# Altium schematic sheet Boost.SchDoc
size Letter
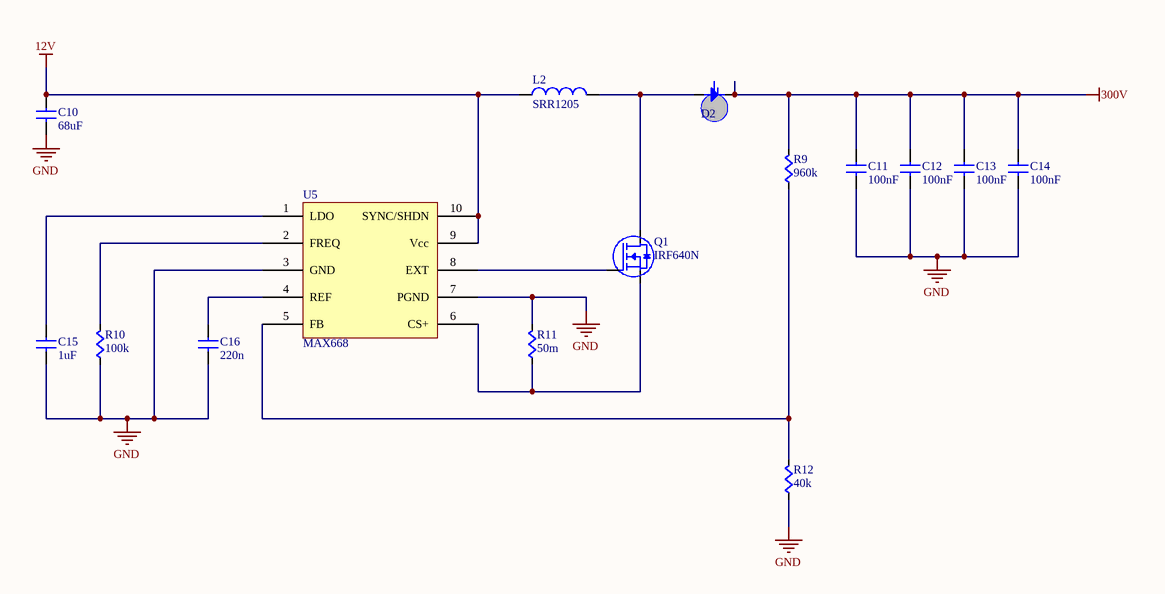
[diagram p0: Boost.SchDoc]

## Parts
C10  value 68uF  [CAPC0603]  (hidden comment: Cap)
C11  value 100nF  [CAPC0603]  (hidden comment: Cap)
C12  value 100nF  [CAPC0603]  (hidden comment: Cap)
C13  value 100nF  [CAPC0603]  (hidden comment: Cap)
C14  value 100nF  [CAPC0603]  (hidden comment: Cap)
C15  value 1uF  [CAPC0402]  (hidden comment: Cap)
C16  value 220n  [CAPC0402]  (hidden comment: Cap)
D2  Diode  [TEMD5510FX01]  (value not drawn)
L2  SRR1205  [SRR1205]
Q1  IRF640N  [IRF640N]
R9  value 960k  [RES0603]  (hidden comment: Res)
R10  value 100k  [RES0603]  (hidden comment: Res)
R11  value 50m  [RES0603]  (hidden comment: Res)
R12  value 40k  [RES0603]  (hidden comment: Res)
U5  MAX668  [MAX668]

## Nets
12V: C10.1(A) L2.1(A) U5.9(Vcc) U5.10(SYNC/SHDN)
300V: C11.1(A) C12.1(A) C13.1(A) C14.1(A) D2.C R9.1(A)
GND: C10.2(B) C11.2(B) C12.2(B) C13.2(B) C14.2(B) C15.2(B) C16.2(B) R10.2(B) R11.1(A) R12.2(B) U5.3(GND) U5.7(PGND)
NetC15_1: C15.1(A) U5.1(LDO)
NetC16_1: C16.1(A) U5.4(REF)
NetD2_A: D2.A L2.2(B) Q1.D
NetQ1_G: Q1.G U5.8(EXT)
NetQ1_S: Q1.S R11.2(B) U5.6(CS+)
NetR9_2: R9.2(B) R12.1(A) U5.5(FB)
NetR10_1: R10.1(A) U5.2(FREQ)

## Library data of the parts
D2 = Diode: Standard Diode Template
L2 = SRR1205: FIXED IND 3MH 500MA 3.5 OHM SMD; Supplier 1: Digi-Key; Supplier Part Number 1: SRR1205-101KLCT-ND
Q1 = IRF640N: MOSFET N-CH 200V 18A D2PAK; Supplier 1: Digi-Key; Supplier Part Number 1: IRF640NSTRLPBFCT-ND
U5 = MAX668: IC REG CTRLR PWM HYBRID 10-UMAX; Supplier 1: Digi-Key; Supplier Part Number 1: MAX668EUB+TCT-ND
C10-C16 = Cap: Supplier 1: Digi-Key; Supplier Part Number 1: 1276-1000-1-ND
R9-R12 = Res: Supplier 1: Digi-Key; Supplier Part Number 1: RMCF0603JT10K0CT-ND